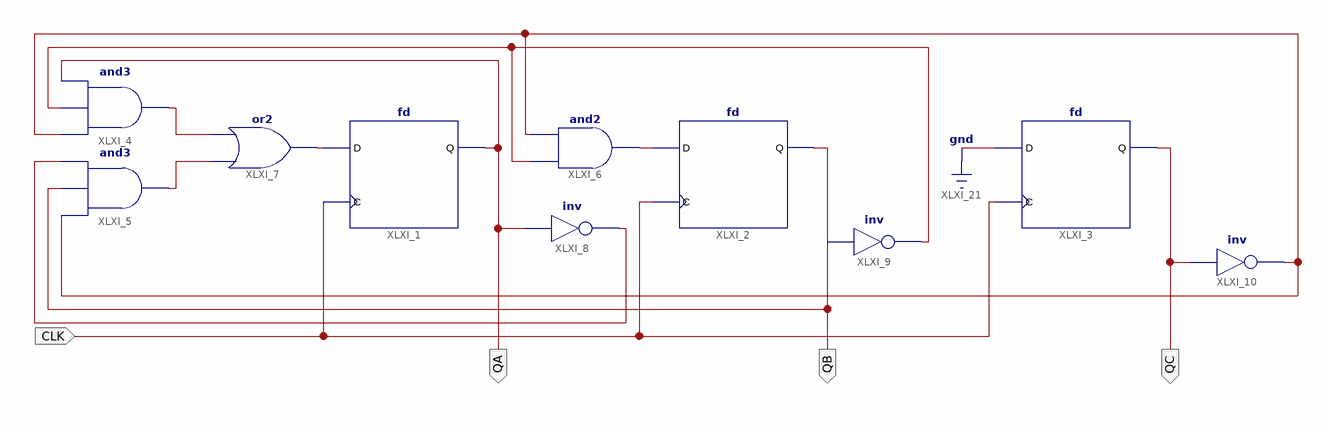
[diagram p0: schematic sheet 1]
// Xilinx ISE schematic Part1B.sch (spartan3e) as structural Verilog: 10 symbols, 4 ports
module Part1B (
  input  CLK,
  output QC,
  output QB,
  output QA
);

  wire XLXN_9, XLXN_10, XLXN_11, XLXN_14, XLXN_17, XLXN_18, XLXN_40;

  and XLXI_4 (XLXN_9, XLXN_18, XLXN_17, QA);
  and XLXI_6 (XLXN_14, XLXN_17, XLXN_18);
  or XLXI_7 (XLXN_11, XLXN_10, XLXN_9);
  fd XLXI_3 (.C(CLK), .D(1'b0), .Q(QC));
  not XLXI_8 (XLXN_40, QA);
  not XLXI_9 (XLXN_17, QB);
  fd XLXI_2 (.C(CLK), .D(XLXN_14), .Q(QB));
  fd XLXI_1 (.C(CLK), .D(XLXN_11), .Q(QA));
  and XLXI_5 (XLXN_10, XLXN_18, QB, XLXN_40);
  not XLXI_10 (XLXN_18, QC);
endmodule
